# EAGLE design AS3364_DG412_bus_mixer_v1.4-4-layer (EAGLE 7.7.0)
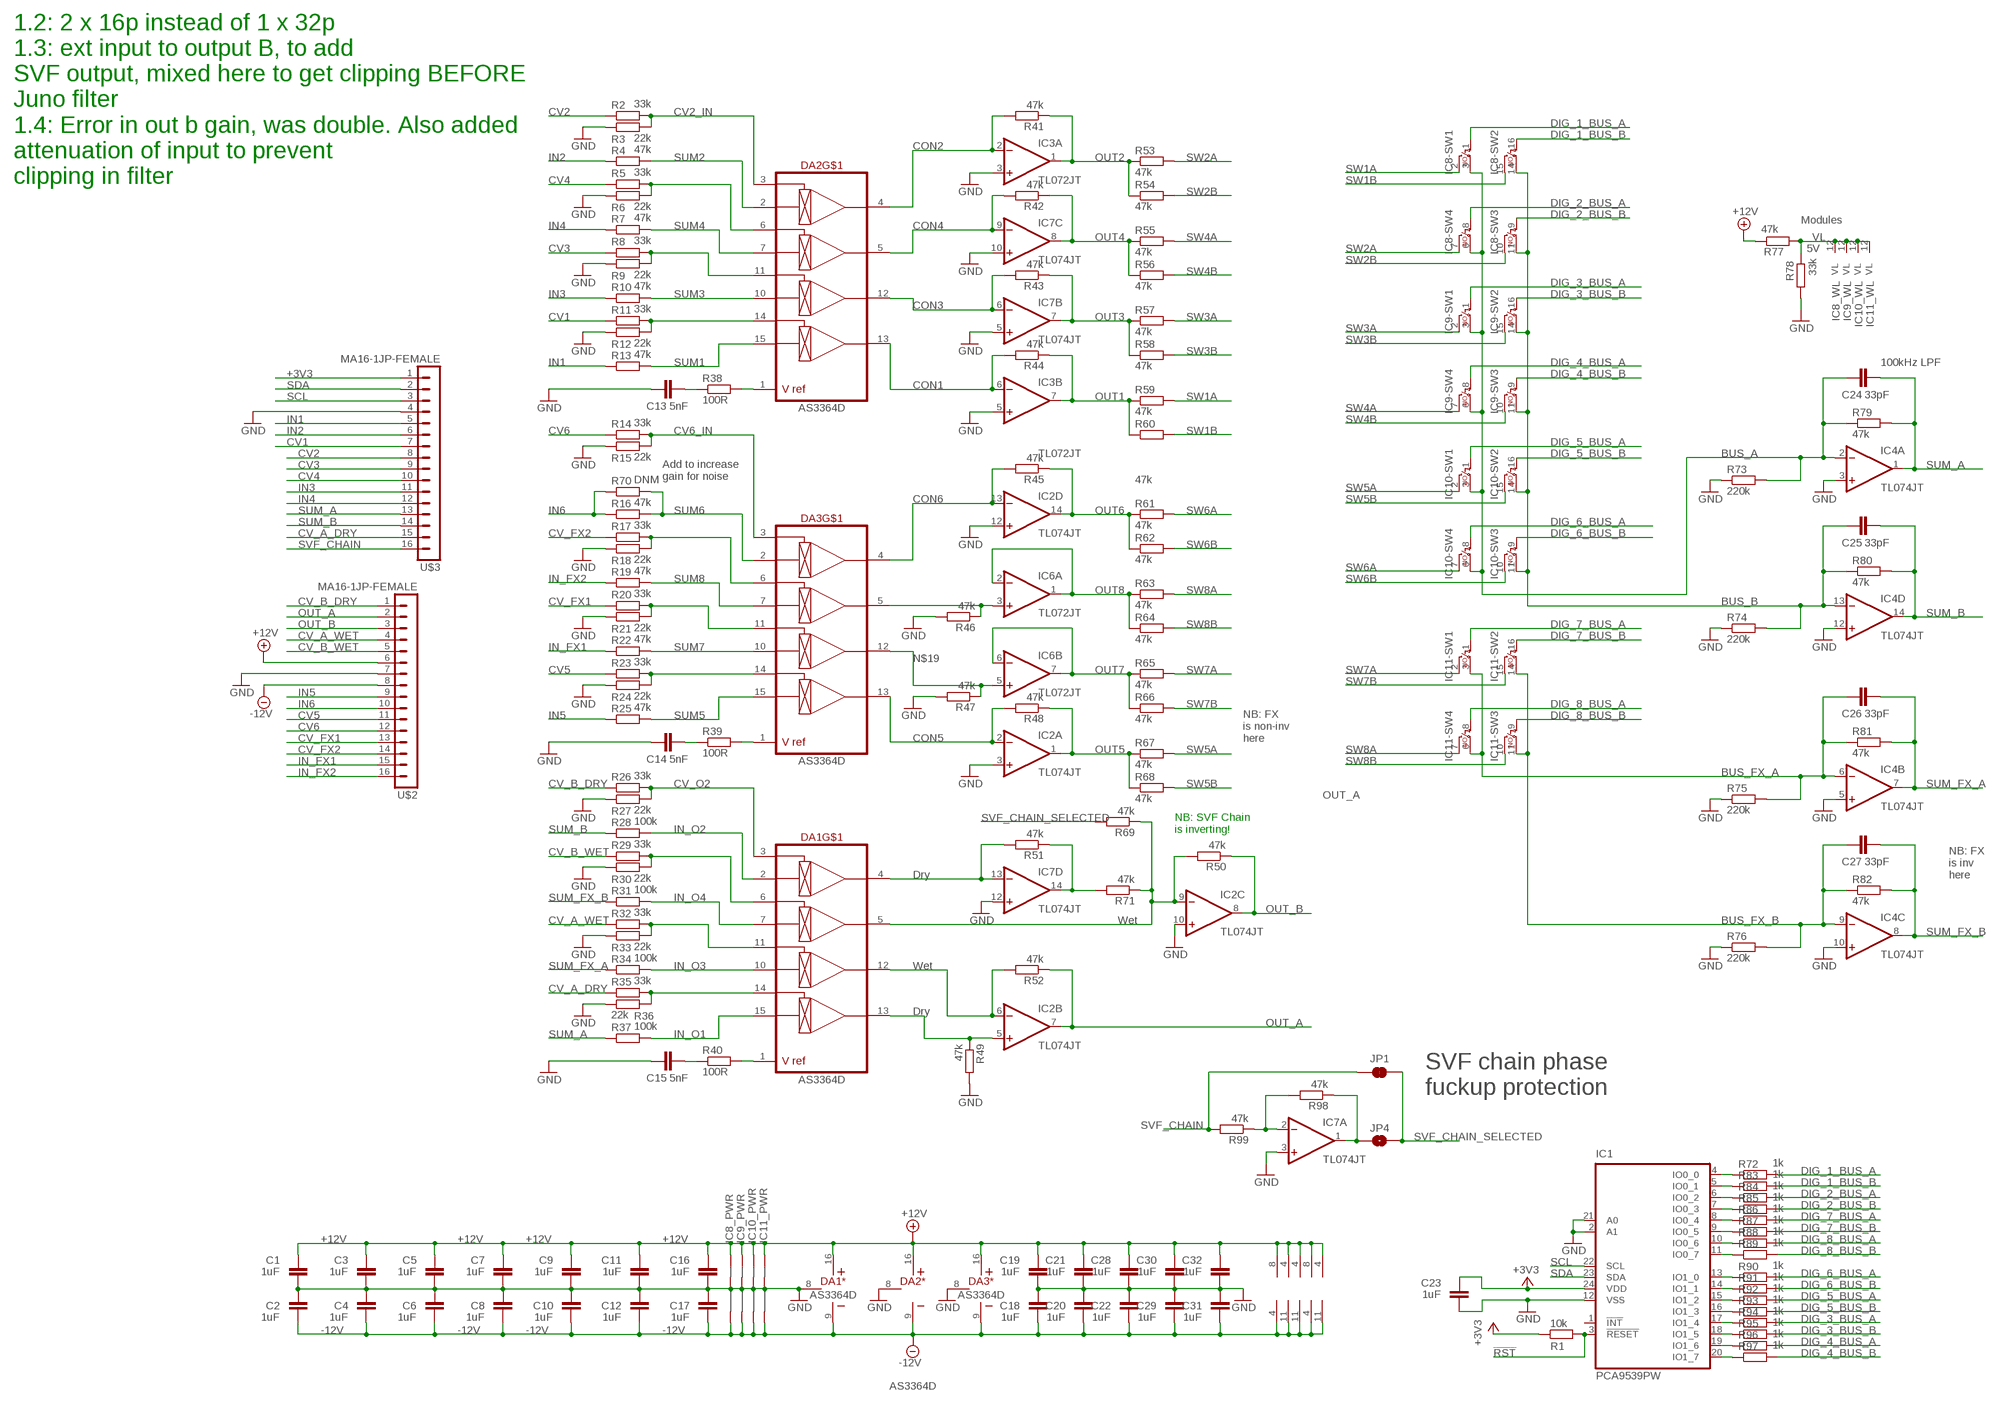
[diagram p0: schematic, sheet 1]

## Parts
C1  1uF  C-EU-J0402  [C0402-J]
C2  1uF  C-EU-J0402  [C0402-J]
C3  1uF  C-EU-J0402  [C0402-J]
C4  1uF  C-EU-J0402  [C0402-J]
C5  1uF  C-EU-J0402  [C0402-J]
C6  1uF  C-EU-J0402  [C0402-J]
C7  1uF  C-EU-J0402  [C0402-J]
C8  1uF  C-EU-J0402  [C0402-J]
C9  1uF  C-EU-J0402  [C0402-J]
C10  1uF  C-EU-J0402  [C0402-J]
C11  1uF  C-EU-J0402  [C0402-J]
C12  1uF  C-EU-J0402  [C0402-J]
C13  5nF  C-EU-J0402  [C0402-J]
C14  5nF  C-EU-J0402  [C0402-J]
C15  5nF  C-EU-J0402  [C0402-J]
C16  1uF  C-EU-J0402  [C0402-J]
C17  1uF  C-EU-J0402  [C0402-J]
C18  1uF  C-EU-J0402  [C0402-J]
C19  1uF  C-EU-J0402  [C0402-J]
C20  1uF  C-EU-J0402  [C0402-J]
C21  1uF  C-EU-J0402  [C0402-J]
C22  1uF  C-EU-J0402  [C0402-J]
C23  1uF  C-EU-J0402  [C0402-J]
C24  33pF  C-EU-J0402  [C0402-J]
C25  33pF  C-EU-J0402  [C0402-J]
C26  33pF  C-EU-J0402  [C0402-J]
C27  33pF  C-EU-J0402  [C0402-J]
C28  1uF  C-EU-J0402  [C0402-J]
C29  1uF  C-EU-J0402  [C0402-J]
C30  1uF  C-EU-J0402  [C0402-J]
C31  1uF  C-EU-J0402  [C0402-J]
C32  1uF  C-EU-J0402  [C0402-J]
DA1  AS3364D  [DIL16J]
DA2  AS3364D  [DIL16J]
DA3  AS3364D  [DIL16J]
IC1  PCA9539PW  [TSSOP24J]
IC2  TL074JT  [TSSOP14J]
IC3  TL072JT  [TSSOP8J]
IC4  TL074JT  [TSSOP14J]
IC6  TL072JT  [TSSOP8J]
IC7  TL074JT  [TSSOP14J]
IC8  DG412-J  [DIL16J]
IC9  DG412-J  [DIL16J]
IC10  DG412-J  [DIL16J]
IC11  DG412-J  [DIL16J]
JP1  JUMPER-SMT_2_NC_TRACE_SILK-DNM  JUMPER-SMT_2_NC_TRACE_SILK  [SMT-JUMPER_2_NC_TRACE_SILK]
JP4  JUMPER-SMT_2_NO_SILK-DNM  JUMPER-SMT_2_NO_SILK  [SMT-JUMPER_2_NO_SILK]
R1  10k  R-EU_R0402  [R0402]
R2  33k  R-EU_R0402  [R0402]
R3  22k  R-EU_R0402  [R0402]
R4  47k  R-EU_R0402  [R0402]
R5  33k  R-EU_R0402  [R0402]
R6  22k  R-EU_R0402  [R0402]
R7  47k  R-EU_R0402  [R0402]
R8  33k  R-EU_R0402  [R0402]
R9  22k  R-EU_R0402  [R0402]
R10  47k  R-EU_R0402  [R0402]
R11  33k  R-EU_R0402  [R0402]
R12  22k  R-EU_R0402  [R0402]
R13  47k  R-EU_R0402  [R0402]
R14  33k  R-EU_R0402  [R0402]
R15  22k  R-EU_R0402  [R0402]
R16  47k  R-EU_R0402  [R0402]
R17  33k  R-EU_R0402  [R0402]
R18  22k  R-EU_R0402  [R0402]
R19  47k  R-EU_R0402  [R0402]
R20  33k  R-EU_R0402  [R0402]
R21  22k  R-EU_R0402  [R0402]
R22  47k  R-EU_R0402  [R0402]
R23  33k  R-EU_R0402  [R0402]
R24  22k  R-EU_R0402  [R0402]
R25  47k  R-EU_R0402  [R0402]
R26  33k  R-EU_R0402  [R0402]
R27  22k  R-EU_R0402  [R0402]
R28  100k  R-EU_R0402  [R0402]
R29  33k  R-EU_R0402  [R0402]
R30  22k  R-EU_R0402  [R0402]
R31  100k  R-EU_R0402  [R0402]
R32  33k  R-EU_R0402  [R0402]
R33  22k  R-EU_R0402  [R0402]
R34  100k  R-EU_R0402  [R0402]
R35  33k  R-EU_R0402  [R0402]
R36  22k  R-EU_R0402  [R0402]
R37  100k  R-EU_R0402  [R0402]
R38  100R  R-EU_R0402  [R0402]
R39  100R  R-EU_R0402  [R0402]
R40  100R  R-EU_R0402  [R0402]
R41  47k  R-EU_R0402  [R0402]
R42  47k  R-EU_R0402  [R0402]
R43  47k  R-EU_R0402  [R0402]
R44  47k  R-EU_R0402  [R0402]
R45  47k  R-EU_R0402  [R0402]
R46  47k  R-EU_R0402  [R0402]
R47  47k  R-EU_R0402  [R0402]
R48  47k  R-EU_R0402  [R0402]
R49  47k  R-EU_R0402  [R0402]
R50  47k  R-EU_R0402  [R0402]
R51  47k  R-EU_R0402  [R0402]
R52  47k  R-EU_R0402  [R0402]
R53  47k  R-EU_R0402  [R0402]
R54  47k  R-EU_R0402  [R0402]
R55  47k  R-EU_R0402  [R0402]
R56  47k  R-EU_R0402  [R0402]
R57  47k  R-EU_R0402  [R0402]
R58  47k  R-EU_R0402  [R0402]
R59  47k  R-EU_R0402  [R0402]
R60  47k  R-EU_R0402  [R0402]
R61  47k  R-EU_R0402  [R0402]
R62  47k  R-EU_R0402  [R0402]
R63  47k  R-EU_R0402  [R0402]
R64  47k  R-EU_R0402  [R0402]
R65  47k  R-EU_R0402  [R0402]
R66  47k  R-EU_R0402  [R0402]
R67  47k  R-EU_R0402  [R0402]
R68  47k  R-EU_R0402  [R0402]
R69  47k  R-EU_R0402  [R0402]
R70  DNM  R-EU_R0805  [R0805]
R71  47k  R-EU_R0402  [R0402]
R72  1k  R-EU_R0402  [R0402]
R73  220k  R-EU_R0603  [R0603]
R74  220k  R-EU_R0603  [R0603]
R75  220k  R-EU_R0603  [R0603]
R76  220k  R-EU_R0603  [R0603]
R77  47k  R-EU_R0402  [R0402]
R78  33k  R-EU_R0402  [R0402]
R79  47k  R-EU_R0402  [R0402]
R80  47k  R-EU_R0402  [R0402]
R81  47k  R-EU_R0402  [R0402]
R82  47k  R-EU_R0402  [R0402]
R83  1k  R-EU_R0402  [R0402]
R84  1k  R-EU_R0402  [R0402]
R85  1k  R-EU_R0402  [R0402]
R86  1k  R-EU_R0402  [R0402]
R87  1k  R-EU_R0402  [R0402]
R88  1k  R-EU_R0402  [R0402]
R89  1k  R-EU_R0402  [R0402]
R90  1k  R-EU_R0402  [R0402]
R91  1k  R-EU_R0402  [R0402]
R92  1k  R-EU_R0402  [R0402]
R93  1k  R-EU_R0402  [R0402]
R94  1k  R-EU_R0402  [R0402]
R95  1k  R-EU_R0402  [R0402]
R96  1k  R-EU_R0402  [R0402]
R97  1k  R-EU_R0402  [R0402]
R98  47k  R-EU_R0402  [R0402]
R99  47k  R-EU_R0402  [R0402]
U$2  MA16-1JP-FEMALE  MA16-1JP  [SIP-PIN16-1J]
U$3  MA16-1JP-FEMALE  MA16-1JP  [SIP-PIN16-1J]

## Nets
!RST: IC1.3(!RESET) R1.2
+3V3: C23.2 IC1.24(VDD) R1.1 U$3.1
+12V: C1.2 C3.2 C5.2 C7.2 C9.2 C11.2 C16.2 C19.2 C21.2 C28.2 C30.2 C32.2 DA1.16(*:V+) DA2.16(*:V+) DA3.16(*:V+) IC2.4(P:V+) IC3.8(P:V+) IC4.4(P:V+) IC6.8(P:V+) IC7.4(P:V+) IC8.13(_PWR:+15V) IC9.13(_PWR:+15V) IC10.13(_PWR:+15V) IC11.13(_PWR:+15V) R77.1 U$2.6
-12V: C2.1 C4.1 C6.1 C8.1 C10.1 C12.1 C17.1 C18.1 C20.1 C22.1 C29.1 C31.1 DA1.9(*:V-) DA2.9(*:V-) DA3.9(*:V-) IC2.11(P:V-) IC3.4(P:V-) IC4.11(P:V-) IC6.4(P:V-) IC7.11(P:V-) IC8.4(_PWR:-15V) IC9.4(_PWR:-15V) IC10.4(_PWR:-15V) IC11.4(_PWR:-15V) U$2.8
BUS_A: C24.1 IC4.2(A:-IN) IC8.3(-SW1:S) IC8.6(-SW4:S) IC9.3(-SW1:S) IC9.6(-SW4:S) IC10.3(-SW1:S) IC10.6(-SW4:S) R73.2 R79.1
BUS_B: C25.1 IC4.13(D:-IN) IC8.11(-SW3:S) IC8.14(-SW2:S) IC9.11(-SW3:S) IC9.14(-SW2:S) IC10.11(-SW3:S) IC10.14(-SW2:S) R74.2 R80.1
BUS_FX_A: C26.1 IC4.6(B:-IN) IC11.3(-SW1:S) IC11.6(-SW4:S) R75.2 R81.1
BUS_FX_B: C27.1 IC4.9(C:-IN) IC11.11(-SW3:S) IC11.14(-SW2:S) R76.2 R82.1
CON1: DA2.13(OUT4) IC3.6(B:-IN) R44.2
CON2: DA2.4(OUT1) IC3.2(A:-IN) R41.2
CON3: DA2.12(OUT3) IC7.6(B:-IN) R43.2
CON4: DA2.5(OUT2) IC7.9(C:-IN) R42.2
CON5: DA3.13(OUT4) IC2.2(A:-IN) R48.2
CON6: DA3.4(OUT1) IC2.13(D:-IN) R45.2
CON_O1: DA1.12(OUT3) IC2.6(B:-IN) R52.2
CV1: R11.1 U$3.7
CV2: R2.1 U$3.8
CV2_IN: DA2.3(CV1) R2.2 R3.2
CV3: R8.1 U$3.9
CV4: R5.1 U$3.10
CV5: R23.1 U$2.11
CV6: R14.1 U$2.12
CV6_IN: DA3.3(CV1) R14.2 R15.2
CV_A_DRY: R35.1 U$3.15
CV_A_WET: R32.1 U$2.4
CV_B_DRY: R26.1 U$2.1
CV_B_WET: R29.1 U$2.5
CV_FX1: R20.1 U$2.13
CV_FX2: R17.1 U$2.14
CV_O2: DA1.3(CV1) R26.2 R27.2
DIG_1_BUS_A: IC8.1(-SW1:C) R72.2
DIG_1_BUS_B: IC8.16(-SW2:C) R83.2
DIG_2_BUS_A: IC8.8(-SW4:C) R84.2
DIG_2_BUS_B: IC8.9(-SW3:C) R85.2
DIG_3_BUS_A: IC9.1(-SW1:C) R94.2
DIG_3_BUS_B: IC9.16(-SW2:C) R95.2
DIG_4_BUS_A: IC9.8(-SW4:C) R96.2
DIG_4_BUS_B: IC9.9(-SW3:C) R97.2
DIG_5_BUS_A: IC10.1(-SW1:C) R92.2
DIG_5_BUS_B: IC10.16(-SW2:C) R93.2
DIG_6_BUS_A: IC10.8(-SW4:C) R90.2
DIG_6_BUS_B: IC10.9(-SW3:C) R91.2
DIG_7_BUS_A: IC11.1(-SW1:C) R86.2
DIG_7_BUS_B: IC11.16(-SW2:C) R87.2
DIG_8_BUS_A: IC11.8(-SW4:C) R88.2
DIG_8_BUS_B: IC11.9(-SW3:C) R89.2
GND: C1.1 C2.2 C3.1 C4.2 C5.1 C6.2 C7.1 C8.2 C9.1 C10.2 C11.1 C12.2 C13.1 C14.1 C15.1 C16.1 C17.2 C18.2 C19.1 C20.2 C21.1 C22.2 C23.1 C28.1 C29.2 C30.1 C31.2 C32.1 DA1.8(*:GND) DA2.8(*:GND) DA3.8(*:GND) IC1.2(A1) IC1.12(VSS) IC1.21(A0) IC2.3(A:+IN) IC2.10(C:+IN) IC2.12(D:+IN) IC3.3(A:+IN) IC3.5(B:+IN) IC4.3(A:+IN) IC4.5(B:+IN) IC4.10(C:+IN) IC4.12(D:+IN) IC7.3(A:+IN) IC7.5(B:+IN) IC7.10(C:+IN) IC7.12(D:+IN) IC8.5(_PWR:AGND) IC9.5(_PWR:AGND) IC10.5(_PWR:AGND) IC11.5(_PWR:AGND) R3.1 R6.1 R9.1 R12.1 R15.1 R18.1 R21.1 R24.1 R27.1 R30.1 R33.1 R36.1 R46.2 R47.2 R49.2 R73.1 R74.1 R75.1 R76.1 R78.2 U$2.7 U$3.4
IN1: R13.1 U$3.5
IN2: R4.1 U$3.6
IN3: R10.1 U$3.11
IN4: R7.1 U$3.12
IN5: R25.1 U$2.9
IN6: R16.1 R70.1 U$2.10
IN_FX1: R22.1 U$2.15
IN_FX2: R19.1 U$2.16
IN_O1: DA1.15(IN4) R37.2
IN_O2: DA1.2(IN1) R28.2
IN_O3: DA1.10(IN3) R34.2
IN_O4: DA1.7(IN2) R31.2
N$1: DA3.1(VREF) R39.2
N$2: DA2.1(VREF) R38.2
N$3: DA3.6(CV2) R17.2 R18.2
N$4: DA3.5(OUT2) IC6.3(A:+IN) R46.1
N$5: DA3.11(CV3) R20.2 R21.2
N$6: DA1.5(OUT2) IC2.9(C:-IN) R50.2 R69.1 R71.1
N$7: DA3.14(CV4) R23.2 R24.2
N$8: C14.2 R39.1
N$9: DA1.1(VREF) R40.2
N$10: DA2.6(CV2) R5.2 R6.2
N$11: DA1.6(CV2) R29.2 R30.2
N$12: DA2.11(CV3) R8.2 R9.2
N$13: DA1.11(CV3) R32.2 R33.2
N$14: C13.2 R38.1
N$15: DA1.14(CV4) R35.2 R36.2
N$16: C15.2 R40.1
N$17: DA1.4(OUT1) IC7.13(D:-IN) R51.2
N$18: DA1.13(OUT4) IC2.5(B:+IN) R49.1
N$19: DA3.12(OUT3) IC6.5(B:+IN) R47.1
N$20: IC7.14(D:OUT) R51.1 R71.2
N$21: DA2.14(CV4) R11.2 R12.2
N$22: IC7.1(A:OUT) JP4.1 R98.1
N$23: IC1.4(IO0_0) R72.1
N$24: IC1.5(IO0_1) R83.1
N$25: IC1.6(IO0_2) R84.1
N$26: IC1.7(IO0_3) R85.1
N$27: IC1.8(IO0_4) R86.1
N$28: IC1.9(IO0_5) R87.1
N$29: IC1.10(IO0_6) R88.1
N$30: IC1.11(IO0_7) R89.1
N$31: IC1.13(IO1_0) R90.1
N$32: IC1.14(IO1_1) R91.1
N$33: IC1.15(IO1_2) R92.1
N$34: IC1.16(IO1_3) R93.1
N$35: IC1.17(IO1_4) R94.1
N$36: IC1.18(IO1_5) R95.1
N$37: IC1.19(IO1_6) R96.1
N$38: IC1.20(IO1_7) R97.1
N$44: IC7.2(A:-IN) R98.2 R99.1
OUT1: IC3.7(B:OUT) R44.1 R59.1 R60.1
OUT2: IC3.1(A:OUT) R41.1 R53.1 R54.1
OUT3: IC7.7(B:OUT) R43.1 R57.1 R58.1
OUT4: IC7.8(C:OUT) R42.1 R55.1 R56.1
OUT5: IC2.1(A:OUT) R48.1 R67.1 R68.1
OUT6: IC2.14(D:OUT) R45.1 R61.1 R62.1
OUT7: IC6.6(B:-IN) IC6.7(B:OUT) R65.1 R66.1
OUT8: IC6.1(A:OUT) IC6.2(A:-IN) R63.1 R64.1
OUT_A: IC2.7(B:OUT) R52.1 U$2.2
OUT_B: IC2.8(C:OUT) R50.1 U$2.3
SCL: IC1.22(SCL) U$3.3
SDA: IC1.23(SDA) U$3.2
SUM1: DA2.15(IN4) R13.2
SUM2: DA2.2(IN1) R4.2
SUM3: DA2.10(IN3) R10.2
SUM4: DA2.7(IN2) R7.2
SUM5: DA3.15(IN4) R25.2
SUM6: DA3.2(IN1) R16.2 R70.2
SUM7: DA3.10(IN3) R22.2
SUM8: DA3.7(IN2) R19.2
SUM_A: C24.2 IC4.1(A:OUT) R37.1 R79.2 U$3.13
SUM_B: C25.2 IC4.14(D:OUT) R28.1 R80.2 U$3.14
SUM_FX_A: C26.2 IC4.7(B:OUT) R34.1 R81.2
SUM_FX_B: C27.2 IC4.8(C:OUT) R31.1 R82.2
SVF_CHAIN: JP1.1 R99.2 U$3.16
SVF_CHAIN_SELECTED: JP1.2 JP4.2 R69.2
SW1A: IC8.2(-SW1:D) R59.2
SW1B: IC8.15(-SW2:D) R60.2
SW2A: IC8.7(-SW4:D) R53.2
SW2B: IC8.10(-SW3:D) R54.2
SW3A: IC9.2(-SW1:D) R57.2
SW3B: IC9.15(-SW2:D) R58.2
SW4A: IC9.7(-SW4:D) R55.2
SW4B: IC9.10(-SW3:D) R56.2
SW5A: IC10.2(-SW1:D) R67.2
SW5B: IC10.15(-SW2:D) R68.2
SW6A: IC10.7(-SW4:D) R61.2
SW6B: IC10.10(-SW3:D) R62.2
SW7A: IC11.2(-SW1:D) R65.2
SW7B: IC11.15(-SW2:D) R66.2
SW8A: IC11.7(-SW4:D) R63.2
SW8B: IC11.10(-SW3:D) R64.2
VL: IC8.12(_WL:VL) IC9.12(_WL:VL) IC10.12(_WL:VL) IC11.12(_WL:VL) R77.2 R78.1
Unconnected: IC1.1(!INT)

## Notes on the sheet
- 1.2: 2 x 16p instead of 1 x 32p
  1.3: ext input to output B, to add
  SVF output, mixed here to get clipping BEFORE
  Juno filter
  1.4: Error in out b gain, was double. Also added 
  attenuation of input to prevent 
  clipping in filter
- Modules
- 5V
- 100kHz LPF
- Add to increase
  gain for noise
- NB: FX
  is non-inv
  here
- NB: SVF Chain
  is inverting!
- Dry
- NB: FX
  is inv
  here
- Wet
- Wet
- Dry
- SVF chain phase
  fuckup protection

## Library data of the parts
C1-C32 = joakim:C-EU-J: CAPACITOR, European symbol
DA1-DA3 = joakim:AS3364: AS3364 quad linear VCA, CEM3360 style. CV is 0 to 2V Vcc-Vee = 26V max, so +/-12V or +15V/-9V
IC1 = joakim:PCA9539: 16ch i/o expander. RPW version resets only internal statemachine to get out of stuck i2c-bus, other versions also reset outputs. Interrupt output requires external pull-up resistor for all variants. https://www.nxp.com/docs/en/data-sheet/PCA9539_PCA9539R.pdf
IC2 IC4 IC7 = joakim:TL074J: OP AMP
IC3 IC6 = joakim:TL072J: OP AMP
IC8-IC11 = joakim:DG412-J: Quad switch, normally open
JP1 = SparkFun-Jumpers:JUMPER-SMT_2_NC_TRACE: Normally closed trace jumper This jumper has a trace between two pads so it's normally closed (NC). Use a razor knife to open the connection. For best results follow the IPC guidelines for cutting traces: Cutout at least 0.063 mm (0.005 in). Remove all loose material to clean up the cut area. Seal the cut with an approved epoxy. Reapply solder to reclose the connection.
JP4 = SparkFun-Jumpers:JUMPER-SMT_2_NO: Normally open jumper This jumper has two pads in close proximity to each other. Apply solder to close the connection. Round pads are easier to solder for beginners, but are a lot larger. SparkFun Product that uses the round pads: SparkFun EL Sequencer <https://www.sparkfun.com/products/12781>
R1-R99 = rcl:R-EU_: RESISTOR, European symbol; SPICEPREFIX: R
U$2 U$3 = joakim:MA16-1J

## Board
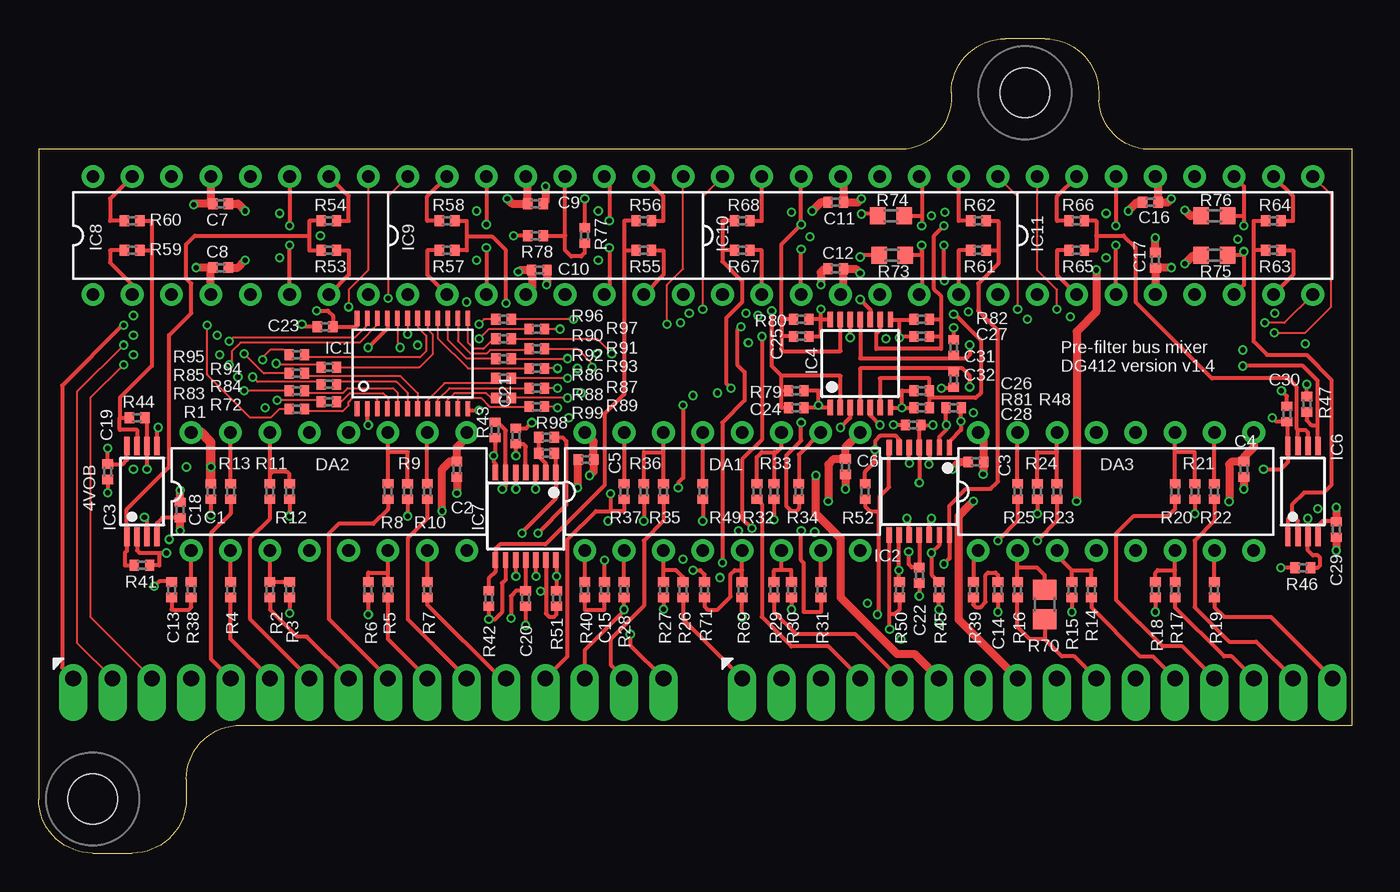
[diagram p1: board, top side]
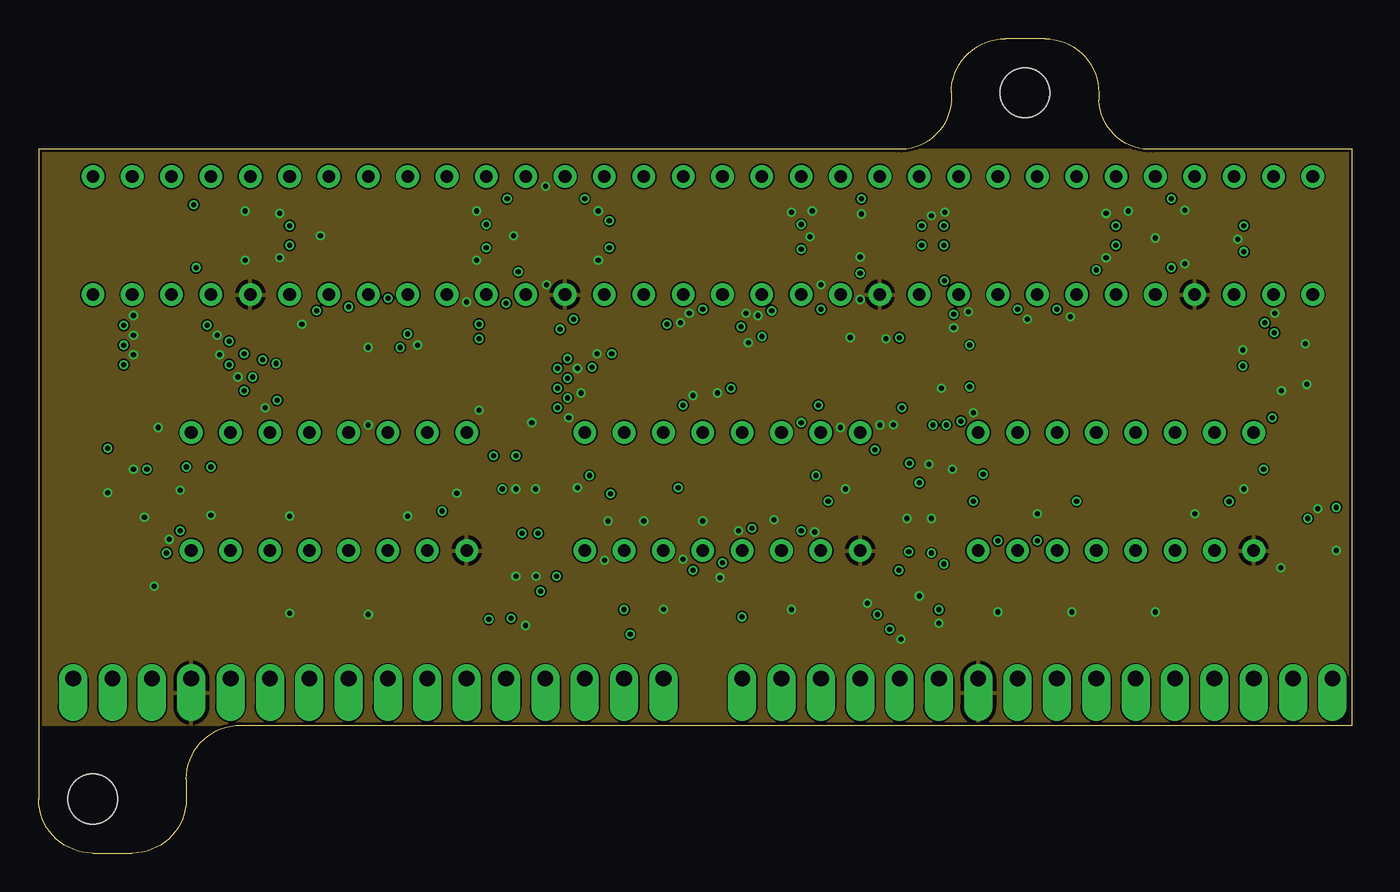
[diagram p2: board, inner layer Route2]
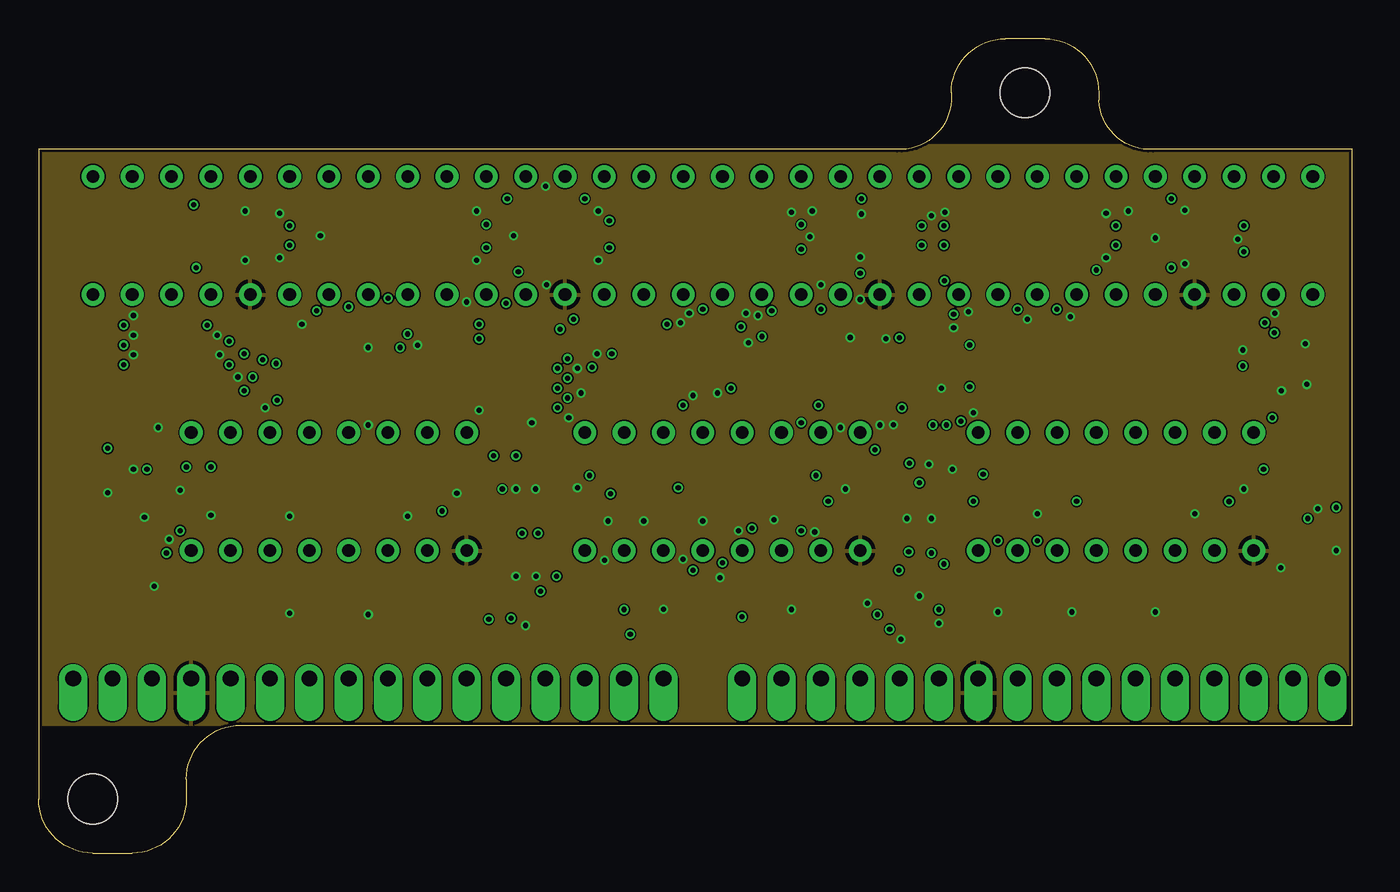
[diagram p3: board, inner layer Route15]
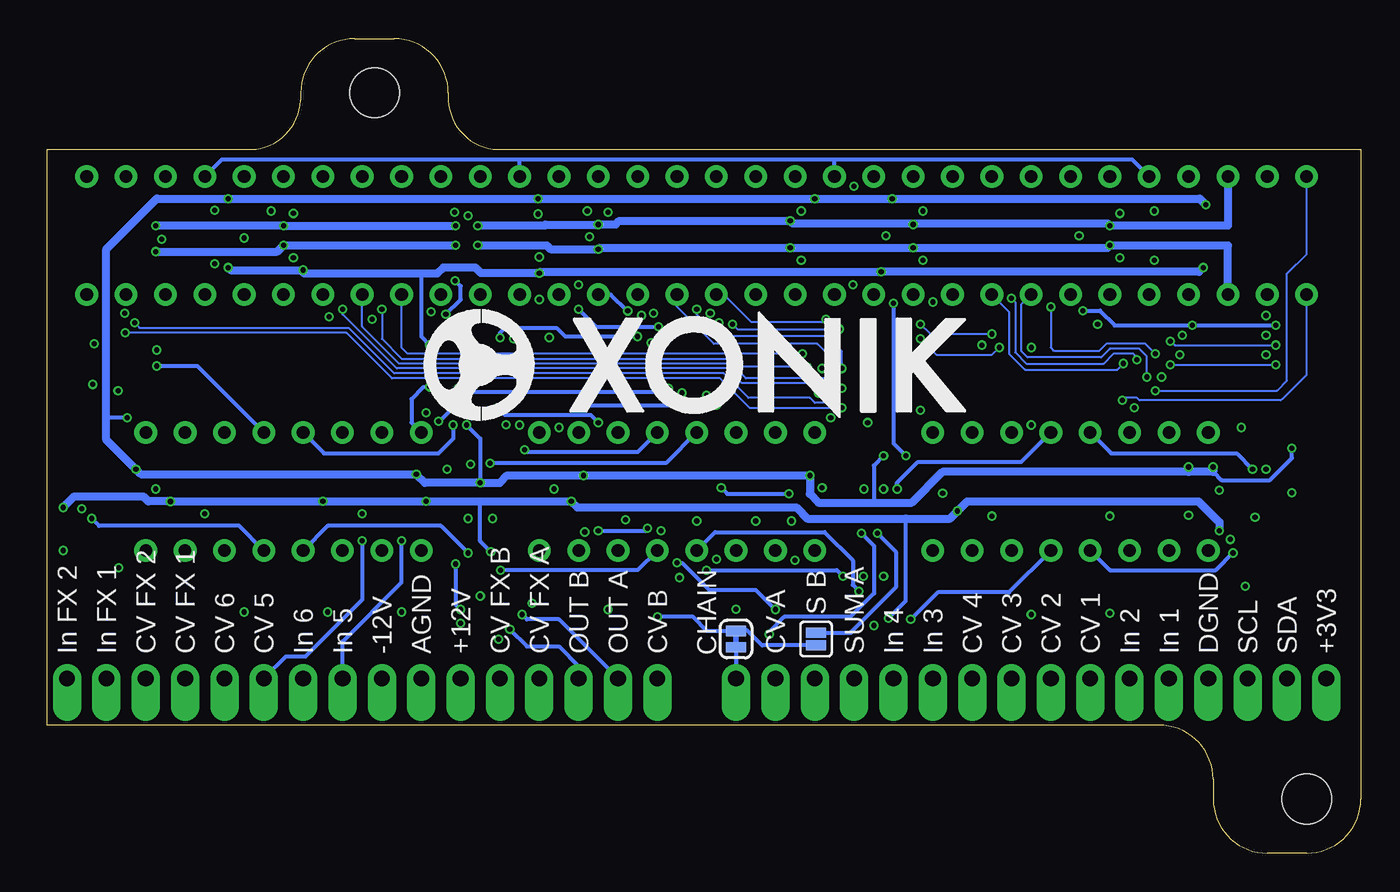
[diagram p4: board, bottom side, seen from below]

Size 84.77 x 52.55 mm. Coordinates in mm from the lower left corner, seen from the top.
Outline: 3.49,0 6.03,0 arc90 9.52,3.49 9.52,4.76 arc-90 13.02,8.26 84.77,8.26 84.77,45.4 71.91,45.4 arc-90 68.42,48.58 68.42,49.05 arc90 64.93,52.55 62.39,52.55 arc90 58.9,49.05 58.9,48.58 arc-90 55.4,45.4 0,45.4 0,3.49 arc90 3.49,0
Copper layers (1+2*15+16): Top 0.035mm / dielectric 0.2mm / Route2 0.0175mm / dielectric 1.065mm / Route15 0.0175mm / dielectric 0.2mm / Bottom 0.035mm
Design rules "jlcpcb-4layers": minimum track width 3.5mil, minimum drill 0.2mm, track to track 3.5mil, track to pad 5mil, pad to pad 5mil, via to via 5mil, smd to smd 5mil, copper to edge 0.2mm, drill to drill 6mil, minimum pad ring 10mil, minimum via ring 0.13mm, stop-mask expansion 0.05mm, vias tented up to drill 16mil, thermal gap 10mil
Holes 3.2 mm at 63.66,49.05 3.49,3.49

### Footprints (pad centres in the part's own frame; a part is rotated, then mirrored left to right if it is on the bottom)
C0402-J = smd 0.6 x 0.7: 1 -0.5,0; 2 0.5,0
DIL16J = drill 0.813: 1 -8.89,-3.81; 2 -6.35,-3.81; 3 -3.81,-3.81; 4 -1.27,-3.81; 5 1.27,-3.81; 6 3.81,-3.81; 7 6.35,-3.81; 8 8.89,-3.81; 9 8.89,3.81; 10 6.35,3.81; 11 3.81,3.81; 12 1.27,3.81; 13 -1.27,3.81; 14 -3.81,3.81; 15 -6.35,3.81; 16 -8.89,3.81
TSSOP24J = smd 0.305 x 0.991: 1 -3.575,-2.918; 2 -2.925,-2.918; 3 -2.275,-2.918; 4 -1.625,-2.918; 5 -0.975,-2.918; 6 -0.325,-2.918; 7 0.325,-2.918; 8 0.975,-2.918; 9 1.625,-2.918; 10 2.275,-2.918; 11 2.925,-2.918; 12 3.575,-2.918; 13 3.575,2.918; 14 2.925,2.918; 15 2.275,2.918; 16 1.625,2.918; 17 0.975,2.918; 18 0.325,2.918; 19 -0.325,2.918; 20 -0.975,2.918; 21 -1.625,2.918; 22 -2.275,2.918; 23 -2.925,2.918; 24 -3.575,2.918
TSSOP14J = smd 0.35 x 1: 1 -1.95,-2.825; 2 -1.3,-2.825; 3 -0.65,-2.825; 4 0,-2.825; 5 0.65,-2.825; 6 1.3,-2.825; 7 1.95,-2.825; 8 1.95,2.825; 9 1.3,2.825; 10 0.65,2.825; 11 0,2.825; 12 -0.65,2.825; 13 -1.3,2.825; 14 -1.95,2.825
TSSOP8J = smd 1.2 x 0.35: 1 -2.925,0.975; 2 -2.925,0.325; 3 -2.925,-0.325; 4 -2.925,-0.975; 5 2.925,-0.975; 6 2.925,-0.325; 7 2.925,0.325; 8 2.925,0.975
SMT-JUMPER_2_NC_TRACE_SILK = smd 0.66 x 1.27: 1 -0.521,0; 2 0.521,0
SMT-JUMPER_2_NO_SILK = smd 0.635 x 1.27: 1 -0.406,0; 2 0.406,0
R0402 = smd 0.6 x 0.7: 1 -0.5,0; 2 0.5,0
R0805 = smd 1.3 x 1.5: 1 -0.95,0; 2 0.95,0
R0603 = smd 1 x 1.1: 1 -0.85,0; 2 0.85,0
SIP-PIN16-1J = drill 1.016 offset: 1 -19.05,0; 2 -16.51,0; 3 -13.97,0; 4 -11.43,0; 5 -8.89,0; 6 -6.35,0; 7 -3.81,0; 8 -1.27,0; 9 1.27,0; 10 3.81,0; 11 6.35,0; 12 8.89,0; 13 11.43,0; 14 13.97,0; 15 16.51,0; 16 19.05,0

### Placement (x,y rotation side)
C1  11.11,23.34 90 top
C2  26.99,24.77 270 top
C3  60.48,25.24 0 top
C4  77.79,24.77 270 top
C5  35.32,25.4 0 top
C6  52.07,24.92 270 top
C7  11.75,41.91 180 top
C8  11.75,37.78 0 top
C9  32.07,41.91 180 top
C10  32.31,37.62 0 top
C11  51.44,41.99 0 top
C12  51.44,37.7 180 top
C13  8.57,16.99 270 top
C14  61.91,16.99 90 top
C15  36.51,16.99 270 top
C16  71.75,41.99 0 top
C17  72.07,38.26 90 top
C18  9.13,22.15 90 top
C19  4.45,24.61 90 top
C20  31.43,16.43 270 top
C21  30.8,26.91 270 top
C22  56.83,17.94 270 top
C23  18.49,33.97 0 top
C24  48.9,29.84 0 top
C25  49.21,33.34 0 top
C26  56.99,29.84 180 top
C27  56.99,33.34 180 top
C28  56.44,27.62 0 top
C29  83.74,20.88 270 top
C30  80.57,28.34 270 top
C31  59.05,32.62 90 top
C32  59.05,30.56 90 top
DA1  44.13,23.34 0 top
DA2  18.73,23.34 0 top
DA3  69.53,23.34 0 top
IC1  24.13,31.59 0 top
IC2  56.83,23.34 180 top
IC3  6.67,23.34 90 top
IC4  53.02,31.59 0 top
IC6  81.6,23.34 90 top
IC7  31.43,21.75 180 top
IC8  12.38,39.85 0 top
IC9  32.7,39.85 0 top
IC10  53.02,39.85 0 top
IC11  73.34,39.85 0 top
JP1  40.32,13.81 90 bottom
JP4  35.16,13.81 270 bottom
R1  16.67,28.65 0 top
R2  14.92,16.99 90 top
R3  16.19,16.99 90 top
R4  12.38,16.99 90 top
R5  22.54,16.99 90 top
R6  21.27,16.99 90 top
R7  25.08,16.99 90 top
R8  22.54,23.34 90 top
R9  23.81,23.34 90 top
R10  25.08,23.34 90 top
R11  14.92,23.34 90 top
R12  16.19,23.34 90 top
R13  12.38,23.34 90 top
R14  67.95,16.99 90 top
R15  66.67,16.99 90 top
R16  63.18,16.99 90 top
R17  73.34,16.99 90 top
R18  72.07,16.99 90 top
R19  75.88,16.99 90 top
R20  73.34,23.34 90 top
R21  74.61,23.34 90 top
R22  75.88,23.34 90 top
R23  65.72,23.34 90 top
R24  64.45,23.34 90 top
R25  63.18,23.34 90 top
R26  41.59,16.99 90 top
R27  40.32,16.99 90 top
R28  37.78,16.99 90 top
R29  47.47,16.99 90 top
R30  48.58,16.99 90 top
R31  50.48,16.99 90 top
R32  46.36,23.34 90 top
R33  47.47,23.34 90 top
R34  49.05,23.34 90 top
R35  40.32,23.34 90 top
R36  39.05,23.34 90 top
R37  37.78,23.34 90 top
R38  9.84,16.99 90 top
R39  60.33,16.99 90 top
R40  35.24,16.99 90 top
R41  6.67,18.57 0 top
R42  29.05,16.43 270 top
R43  29.45,27.3 90 top
R44  6.35,28.1 0 top
R45  58.1,16.99 90 top
R46  81.6,18.41 180 top
R47  81.84,28.97 90 top
R48  59.05,28.73 180 top
R49  42.86,23.34 270 top
R50  55.56,16.99 90 top
R51  33.42,16.43 270 top
R52  53.34,23.34 90 top
R53  18.73,38.89 0 top
R54  18.73,40.8 0 top
R55  39.05,38.89 0 top
R56  39.05,40.8 0 top
R57  26.35,38.89 180 top
R58  26.35,40.8 180 top
R59  6.03,38.89 180 top
R60  6.03,40.8 180 top
R61  60.64,38.89 180 top
R62  60.64,40.8 180 top
R63  79.69,38.89 0 top
R64  79.69,40.8 0 top
R65  66.99,38.89 180 top
R66  66.99,40.8 180 top
R67  45.4,38.89 0 top
R68  45.4,40.8 0 top
R69  45.4,16.99 270 top
R70  64.93,16.03 90 top
R71  42.98,16.99 90 top
R72  18.73,29.13 180 top
R73  55.09,38.58 0 top
R74  55.01,41.12 0 top
R75  75.88,38.58 0 top
R76  75.88,41.12 0 top
R77  35.24,39.85 270 top
R78  32.07,39.85 180 top
R79  48.9,28.73 0 top
R80  49.21,34.45 0 top
R81  56.99,28.73 180 top
R82  56.99,34.45 180 top
R83  16.67,29.84 180 top
R84  18.73,30.24 180 top
R85  16.67,30.96 180 top
R86  30,30.64 0 top
R87  32.15,30 0 top
R88  30,29.37 0 top
R89  32.15,28.81 0 top
R90  30,33.18 0 top
R91  32.15,32.54 0 top
R92  30,31.91 0 top
R93  32.15,31.27 0 top
R94  18.73,31.35 180 top
R95  16.67,32.15 180 top
R96  30,34.45 0 top
R97  32.15,33.81 0 top
R98  32.78,25.8 180 top
R99  32.78,26.83 0 top
U$1  [XONIK_LOGO_35]  60.48,27.94 0 bottom
U$2  64.45,11.27 0 top
U$3  21.27,11.27 0 top

### Tracks (layer width: path | path; a pad name or v marks a point on that pad's centre or on a via)
!RST
  Top 0.127: IC1.3 21.85,29.26 21.75,29.37 20.24,29.37 20,29.13 20,28.89 19.61,28.5 17.33,28.5 R1.2
+3V3  (via drill 0.33)
  Top 0.127: R1.1 15.53,28.65 14.98,28.1 13.65,28.1 10.87,30.88 v10.87,34.05
  Top 0.254: U$3.1 1.51,11.99 1.51,30.16 5.4,34.05 v5.48,34.05 | IC1.24 20.55,34.05 20.48,33.97 C23.2 18.99,34.66 18.65,35 v17.94,35
  Bottom 0.254: v17.94,35 16.83,35 15.88,34.05 v10.87,34.05 v5.48,34.05
+12V  (via drill 0.33, 0.35)
  Top 0.254: v35.24,42.23 R77.1 | IC4.4 53.02,31.27 59.04,31.27 | v79.06,24.77 80.17,24.77 80.64,25.24 80.64,26.24 IC6.8 80.62,27.78 C30.2 79.87,27.84 v79.61,28.1 | v56.83,23.89 IC2.4 56.83,27.52 C28.2 v57.71,27.62 | v4.45,26.11 C19.2 5.42,25.11 5.69,25.38 IC3.8 | C32.2 59.04,31.07 59.04,31.27 | v60.09,30.08 60.09,30.8 59.61,31.27 59.04,31.27 | IC7.4 31.43,26.24 31.26,26.41 C21.2 v30.8,25.64
  Top 0.508: C7.2 11.11,41.91 | 11.11,41.91 10.01,41.91 v10,41.83 | U$2.6 56.51,12.86 55.4,12.86 51.75,16.51 51.75,20.32 50.16,21.91 v50.16,24.37 | IC8.13 11.11,41.91 | v30.24,42.23 30.56,41.91 C9.2 31.57,43.52 IC9.13 | IC10.13 51.94,43.47 C11.2 52.86,41.99 v53.1,42.23 | v73.1,42.23 72.87,41.99 C16.2 72.25,43.47 IC11.13 | DA3.16 60.98,26.8 C3.2 60.98,24.47 v60.96,24.45 | DA1.16 35.82,26.57 C5.2 35.82,24.63 v35.56,24.37
  Top 0.61: C1.2 v11.11,24.92 11.11,26.51 10.48,27.15 DA2.16
  Bottom 0.254: 9.53,24.61 8.99,24.06 5.86,24.06 4.45,25.48 v4.45,26.11 | v79.61,28.1 80.96,28.1 | v60.09,30.08 60.48,30.08 61.28,29.29 61.28,27.78 DA3.16 | v57.71,27.62 56.83,26.75 v56.83,23.89 | v30.8,25.64 31.43,25 31.43,22.62
  Bottom 0.508: v9.52,24.92 9.52,24.61 9.53,24.61 11.11,24.61 | v10,41.83 10.4,42.23 v30.24,42.23 v35.24,42.23 v53.1,42.23 v73.1,42.23 77.71,42.23 80.96,38.97 80.96,28.1 80.96,26.67 v79.06,24.77 78.74,24.45 v60.96,24.45 60.4,23.89 v56.83,23.89 55.56,23.89 55.09,24.37 v50.16,24.37 v35.56,24.37 35.56,23.18 35,22.62 31.43,22.62 28.97,22.62 26.99,24.61 11.11,24.61 | v11.11,24.92 11.11,24.61
-12V  (via drill 0.33, 0.35)
  Top 0.254: IC4.11 53.02,31.91 59.05,31.91 | C18.1 7.99,21.65 7.64,21.3 IC3.4 | IC7.11 C20.1 30.82,16.93 30.48,16.59 v30.48,15.16 | IC2.11 C22.1 56.36,18.44 56.15,18.64 v56.15,19.45 | IC6.4 82.57,21.14 82.87,21.43 83.69,21.43 C29.1 | C31.1 59.05,31.91 | v60.09,32.79 60.09,32.15 59.85,31.91 59.05,31.91
  Top 0.508: DA2.9 27.62,26.83 26.99,26.19 C2.1 26.53,25.27 26.03,24.77 v26.03,22.07 | v68.26,37.62 68.26,34.93 66.99,33.66 v66.99,22.7 | U$2.8 59.37,15.08 59.37,21.75 v60.33,22.7 | C8.1 11.11,37.78 | 11.11,37.78 v10.16,37.78 | IC8.4 11.11,37.78 | IC9.4 31.83,36.43 31.83,37.6 C10.1 31.08,37.62 v30.96,37.51 | v73.1,37.78 73.08,37.76 C17.1 IC11.4 | v76.83,22.7 76.83,25.08 76.99,25.24 77.76,25.24 C4.1 77.79,25.56 78.42,26.19 DA3.9 | DA1.9 52.07,26.19 C6.1 52.05,25.4 51.28,25.4 50.96,25.08 v50.96,22.7 | v53.02,37.43 52.74,37.7 C12.1 51.94,36.22 IC10.4 | v9.13,20.8 C18.1 | v83.74,22.3 C29.1
  Bottom 0.254: v68.26,37.62 68.34,37.54 | v30.48,15.16 29.37,16.27 29.37,21.59 | v56.15,19.45 56.83,20.12 56.83,22.7 | v60.09,32.79 60.64,33.34 60.64,37.39
  Bottom 0.508: v10.16,37.78 10.44,37.51 v30.96,37.51 52.94,37.51 v53.02,37.43 56.79,37.43 57.15,37.78 59.21,37.78 59.61,37.39 60.64,37.39 68.18,37.39 68.34,37.54 | v73.1,37.78 72.95,37.62 v68.26,37.62 | v9.13,20.8 9.13,21.35 10.48,22.7 25.4,22.7 v26.03,22.07 26.51,21.59 29.37,21.59 35.72,21.59 36.43,22.3 50.56,22.3 v50.96,22.7 56.83,22.7 v60.33,22.7 v66.99,22.7 v76.83,22.7 78.26,22.7 78.58,23.02 83.03,23.02 v83.74,22.3
BUS_A  (via drill 0.33)
  Top 0.254: v28.89,39.05 IC9.3 | v36.83,39.05 36.83,36.35 IC9.6 | IC8.6 v16.19,39.21 | IC10.3 v49.21,38.97 | IC10.6 56.99,36.2 v56.99,39.21 56.99,38.58 R73.2 | IC4.2 51.75,28.8 51.75,30.8 47.94,30.8 | v47.31,34.98 47.31,31.43 47.94,30.8 | R79.1 47.94,28.73 47.94,29.84 | 47.94,29.84 47.94,30.8 | C24.1 47.94,29.84
  Bottom 0.254: IC10.3 48.42,36.04 47.37,34.98 v47.31,34.98
  Bottom 0.508: IC8.3 8.57,39.21 v16.19,39.21 16.35,39.05 v28.89,39.05 v36.83,39.05 49.13,39.05 v49.21,38.97 52.31,38.97 52.55,39.21 v56.99,39.21
BUS_B  (via drill 0.33)
  Top 0.254: IC8.11 v16.19,40.48 | IC9.14 v28.89,40.56 | IC9.11 36.83,43.34 v36.83,40.8 | IC10.14 v49.21,40.56 47.94,39.29 47.94,34.45 | 56.99,41.12 v56.99,40.48 | R74.2 56.99,41.12 | 47.94,34.45 47.94,33.34 | 47.94,33.34 47.94,32.38 51.75,32.38 51.75,34.39 IC4.13 | R80.1 47.94,34.45 | IC10.11 56.99,43.5 56.99,41.12 | C25.1 47.94,33.34
  Bottom 0.508: IC8.14 8.57,40.48 v16.19,40.48 16.35,40.64 28.81,40.64 v28.89,40.56 28.97,40.64 36.67,40.64 v36.83,40.8 47.86,40.8 48.1,40.56 v49.21,40.56 52.63,40.56 52.7,40.48 v56.99,40.48
BUS_FX_A  (via drill 0.33)
  Top 0.254: IC11.3 v69.53,39.21 | IC11.6 77.79,36.67 v77.79,38.81 77.79,38.58 R75.2 | IC4.6 54.29,28.8 54.29,30.64 57.47,30.64 57.47,29.87 C26.1 57.47,29.82 57.47,29.37 | v58.45,36.94 58.42,36.98 v58.42,39.21 | R81.1 57.47,28.76 57.47,29.37 | v59.05,34.77 59.13,34.77 60.8,33.1 60.8,29.69 60.48,29.37 57.47,29.37
  Bottom 0.254: v58.45,36.94 58.1,36.59 58.1,35.72 v59.05,34.77
  Bottom 0.508: v77.79,38.81 69.93,38.81 v69.53,39.21 v58.42,39.21
BUS_FX_B  (via drill 0.33)
  Top 0.254: IC11.14 v69.53,40.48 | 77.79,41.12 77.79,43.02 IC11.11 | 77.79,41.12 v77.79,40.48 | R76.2 77.79,41.12 | R82.1 58.26,34.45 | 58.26,33.34 58.26,32.54 54.05,32.54 54.05,33.51 54.32,33.78 IC4.9 | 58.26,33.34 58.26,34.45 | 58.26,34.45 58.26,35.92 57.79,36.39 57.79,39.85 v58.42,40.48 | C27.1 58.26,33.34
  Bottom 0.508: v77.79,40.48 v69.53,40.48 v58.42,40.48
CON1  (via drill 0.33)
  Top 0.254: IC3.6 | R44.2 6.98,28.1 IC3.6 | v6.98,24.77 IC3.6
  Bottom 0.254: DA2.13 16.11,25.8 8.02,25.8 v6.98,24.77
CON2  (via drill 0.35)
  Top 0.254: IC3.2 6.34,19.53 6.51,19.37 v8.26,19.37 7.78,19.37 7.78,18.57 R41.2
  Bottom 0.254: v8.26,19.37 9.37,18.26 16.19,18.26 DA2.4
CON3  (via drill 0.33)
  Top 0.254: R43.2 29.61,27.8 30.13,27.28 IC7.6 30.13,23.7 v29.92,23.5
  Bottom 0.254: DA2.12 21.91,25.24 28.57,25.24 29.92,23.89 v29.92,23.5
CON4  (via drill 0.33)
  Top 0.254: IC7.9 30.13,17.65 29.89,17.42 29.89,15.53 29.45,15.08 v29.05,15.08 R42.2
  Bottom 0.254: DA2.5 22.7,16.83 27.3,16.83 v29.05,15.08
CON5  (via drill 0.33)
  Top 0.254: IC2.2 58.13,26.86 58.58,27.3 v58.58,27.62 58.55,27.65 R48.2
  Bottom 0.254: DA3.13 66.91,25.8 59.53,25.8 58.58,26.75 v58.58,27.62
CON6  (via drill 0.33)
  Top 0.254: R45.2 57.63,17.96 v57.63,19.37 58.13,19.87 IC2.13
  Bottom 0.254: DA3.4 66.67,21.11 59.37,21.11 v57.63,19.37
CON_O1  (via drill 0.33)
  Top 0.254: R52.2 53.34,24.61 53.98,25.24 v53.98,26.04 53.98,26.59 54.3,26.91 55.32,26.91 55.53,26.7 IC2.6
  Bottom 0.254: DA1.12 46.67,25.88 53.82,25.88 v53.98,26.04
CV1
  Top 0.254: R11.1 14.92,21.59 13.65,20.32 13.65,15.08 U$3.7
CV2
  Top 0.254: R2.1 14.92,15.72 16.67,13.97 17.3,13.97 U$3.8
CV2_IN
  Top 0.254: DA2.3 R2.2 R3.2
CV3
  Top 0.254: R8.1 22.54,22.2 21.59,21.25 19.34,21.25 18.73,20.64 18.73,15.1 U$3.9
CV4
  Top 0.254: U$3.10 22.54,13.81 R5.1
CV5  (via drill 0.33)
  Top 0.254: R23.1 65.72,21.43 v64.45,20.16
  Bottom 0.254: U$2.11 69.37,12.7 68.1,12.7 64.45,16.35 v64.45,20.16
CV6
  Top 0.254: R14.1 67.95,15.85 71.12,12.68 71.94,12.68 U$2.12
CV6_IN
  Top 0.254: R14.2 67.95,18.26 66.67,18.26 | 66.67,18.26 65.72,19.21 DA3.3 | R15.2 66.67,18.26
CV_A_DRY
  Top 0.254: R35.1 40.32,21.43 39.05,20.16 39.05,15.95 36.91,13.81 36.91,12.14 U$3.15
CV_A_WET
  Top 0.254: U$2.4 50.96,13.34 48.58,13.34 46.67,15.24 46.67,22.52 R32.1
CV_B_DRY
  Top 0.254: R26.1 41.59,15.08 U$2.1
CV_B_WET
  Top 0.254: R29.1 47.47,15.56 48.9,14.13 52.7,14.13 U$2.5
CV_FX1
  Top 0.254: U$2.13 73.82,13.34 72.55,13.34 69.53,16.35 69.53,20.61 70.64,21.73 72.87,21.73 73.34,22.2 R20.1
CV_FX2
  Top 0.254: R17.1 73.34,15.88 76.52,12.7 76.99,12.7 U$2.14
CV_O2
  Top 0.254: R27.2 40.32,18.28 | 40.32,18.28 DA1.3 | R26.2 41.59,17.8 41.12,18.28 40.32,18.28
DIG_1_BUS_A  (via drill 0.33)
  Top 0.127: R72.2 18.15,29.21 v15.4,29.21
  Bottom 0.127: v15.4,29.21 15.24,29.37 14.45,29.37 14.29,29.21 5.16,29.21 5.08,29.29 3.49,30.88 IC8.1
DIG_1_BUS_B  (via drill 0.33)
  Top 0.127: R83.2 v13.26,29.84
  Bottom 0.127: v13.26,29.84 5.4,29.84 4.76,30.48 4.76,37.39 3.49,38.66 IC8.16
DIG_2_BUS_A  (via drill 0.33)
  Top 0.127: R84.2 18.07,30.4 14.13,30.4 v13.81,30.72
  Bottom 0.127: IC8.8 21.91,35.4 21.91,32.38 21.51,31.99 16.75,31.99 16.19,32.54 14.29,32.54 13.81,32.07 v13.81,30.72
DIG_2_BUS_B  (via drill 0.33)
  Top 0.127: v20,35.24 20,36.35 21.27,37.62 IC8.9 | v13.26,32.23 14.53,30.96 R85.2
  Bottom 0.127: v20,35.24 20,32.63 19.76,32.38 16.91,32.38 16.43,32.86 13.89,32.86 v13.26,32.23
DIG_3_BUS_A  (via drill 0.33)
  Top 0.127: R94.2 18.07,31.51 15.4,31.51 v15.32,31.59
  Bottom 0.127: v15.32,31.59 15.72,31.19 21.67,31.19 22.7,32.23 22.7,34.93 IC9.1
DIG_3_BUS_B  (via drill 0.33)
  Top 0.127: R95.2 15.85,32.46 14.92,32.46 14.45,31.99 v14.45,31.83 | IC9.16 22.54,42.39 v22.54,35.8
  Bottom 0.127: v22.54,35.8 22.3,35.56 22.3,32.31 21.59,31.59 16.59,31.59 15.95,32.23 14.68,32.23 14.45,31.99 v14.45,31.83
DIG_4_BUS_A  (via drill 0.33)
  Top 0.127: v34.53,34.45 R96.2
  Bottom 0.127: IC9.8 41.12,36.04 39.37,34.29 34.69,34.29 v34.53,34.45
DIG_4_BUS_B  (via drill 0.33)
  Top 0.127: v33.66,33.81 R97.2 | v40.56,34.13 40.56,36.67 41.59,37.7 IC9.9
  Bottom 0.127: v33.66,33.81 40.24,33.81 v40.56,34.13
DIG_5_BUS_A  (via drill 0.33)
  Top 0.127: v34.13,31.91 R92.2
  Bottom 0.127: v34.13,31.91 35.08,32.86 41.75,32.86 44.13,35.24 IC10.1
DIG_5_BUS_B  (via drill 0.33)
  Top 0.127: v33.5,31.27 R93.2 | v42.86,35.08 42.86,42.39 IC10.16
  Bottom 0.127: v33.5,31.27 33.5,32.38 34.45,33.34 41.43,33.34 42.86,34.77 v42.86,35.08
DIG_6_BUS_A  (via drill 0.33)
  Top 0.127: R90.2 36.04,33.18 v36.99,32.23
  Bottom 0.127: v36.99,32.23 61.52,32.23 61.91,32.62 IC10.8
DIG_6_BUS_B  (via drill 0.33)
  Top 0.127: R91.2 34.76,32.54 35.72,31.59 v35.72,31.35 | IC10.9 63.18,42.39 v63.18,35.08
  Bottom 0.127: v35.72,31.35 35.8,31.43 39.93,31.43 40.4,31.91 61.91,31.91 63.18,33.18 v63.18,35.08
DIG_7_BUS_A  (via drill 0.33)
  Top 0.127: v34.13,30.64 R86.2
  Bottom 0.127: v34.13,30.64 39.69,30.64 40.64,31.59 62.07,31.59 64.45,33.97 IC11.1
DIG_7_BUS_B  (via drill 0.33)
  Top 0.127: v33.5,30 R87.2 | v65.72,35.08 65.72,36.35 64.45,37.62 IC11.16
  Bottom 0.127: v33.5,30 34.37,30 34.69,30.32 39.93,30.32 40.88,31.27 62.23,31.27 65.72,34.77 v65.72,35.08
DIG_8_BUS_A  (via drill 0.33)
  Top 0.127: v34.13,29.37 R88.2 | IC11.8 80.41,34.21 v79.14,34.21
  Bottom 0.127: v34.13,29.37 34.45,29.05 35.24,29.05 35.56,29.37 39.53,29.37 41.12,30.96 62.39,30.96 65.33,33.89 78.82,33.89 v79.14,34.21
DIG_8_BUS_B  (via drill 0.33)
  Top 0.127: v33.5,28.73 33.42,28.81 R89.2 | v79.76,33.58 81.74,33.58 83.42,35.26 83.42,42.47 IC11.9
  Bottom 0.127: v33.5,28.73 39.45,28.73 41.35,30.64 62.53,30.64 65.47,33.58 v79.76,33.58
GND  (via drill 0.33)
  Top 0.254: R6.1 v21.27,15.4 | R30.1 v48.58,15.72 | IC4.10 53.67,35.07 v53.02,35.72 | IC4.3 52.37,28.08 v51.75,27.46 | IC4.5 53.67,28.24 v54.29,27.62 | R36.1 v39.05,21.43 | R78.2 v30.64,39.85 | R74.1 54.03,41.24 v53.1,41.24 | R73.1 53.14,38.58 v53.02,38.46 | IC3.5 7.64,27.41 v7.7,27.46 | IC3.3 6.99,21.5 v6.83,21.67 | C13.1 8.52,17.54 7.78,17.54 v7.46,17.22 | R3.1 v16.19,15.48 | R9.1 v23.81,21.75 | IC7.3 32.08,23.51 v32.07,23.5 | IC7.5 30.78,23.51 v30.8,23.5 | v30.8,17.87 30.78,17.89 IC7.10 | IC7.12 32.08,17.89 v32.11,17.86 | R33.1 v47.47,21.51 | R49.2 v42.86,21.43 | R27.1 v40.32,15.73 | C15.1 v36.51,18.89 | C14.1 v61.91,15.56 | R15.1 v66.67,15.56 | R18.1 v72.07,15.56 | R46.2 v80.17,18.41 | IC2.10 56.18,21.45 v56.04,21.59 | IC2.12 57.48,21.45 v57.63,21.59 | IC2.3 57.48,25.1 v57.47,25.08 | R24.1 v64.45,21.91 | R21.1 v74.61,21.91 | R12.1 v16.19,21.75 | C1.1 v11.11,21.79 | C23.1 17.15,33.97 v16.99,34.13 | IC1.2 21.21,27.69 v21.27,27.62 | IC1.12 27.8,28.58 v28.42,28.58 | IC1.21 22.5,33.86 v21.27,32.62 | C19.1 v4.45,23.26 | C20.2 v31.43,14.68 | C22.2 v56.83,16.59 | R47.2 v81.84,30.24 | C30.1 80.57,29.49 v80.21,29.84 | C32.1 59,30 v58.26,30 | C31.2 v59.05,33.89 | C28.1 55.18,27.62 v55.17,27.63 | C21.1 31.46,27.41 v31.83,27.78 | IC4.12 v52.37,33.27
  Top 0.508: 77.77,24.1 C4.2 v77.79,23.5 | C7.1 12.86,41.91 v13.34,41.43 | C8.2 12.86,37.78 v13.34,38.26 | v32.7,43.02 32.73,43 32.73,42.07 C9.1 | C10.2 32.81,36.7 v32.78,36.67 | C11.1 50.48,41.99 v49.93,41.43 | C12.2 50.72,37.7 50.48,37.47 v50.48,36.67 | R75.1 74.53,38.58 v73.98,38.02 | R76.1 74.34,41.12 v73.98,41.48 | v70.33,41.43 70.88,41.99 C16.1 | C17.2 v72.07,39.69 | C2.2 v26.99,23.22 | C6.2 v52.07,23.5 | C18.2 v9.13,23.42 | C29.2 v83.74,19.53 | v58.98,24.78 59.44,25.24 C3.1 | C5.1 34.82,25.32 34.77,25.27 v34.77,23.57
  other vias: 6.11,34.69 6.11,32.15 6.11,33.42 11.51,33.42 11.67,32.15 12.86,30.72 14.61,28.73 27.62,35.56 41.43,34.21 41.99,34.85 43.81,29.69 45.64,34.85 36.04,32.23 34.77,31.27 35,29.69 34.21,28.1 42.23,29.53 36.75,21.43 45.16,20.8 50.09,20.72 41.59,18.97 8.41,20.24 6.11,24.77 43.97,17.78 53.5,16.11 55.64,13.81 58.1,14.84 82.55,22.23 79.77,34.85 81.76,32.86 77.71,32.46 63.82,34.45 66.6,34.61 60.01,34.93 54.69,33.18 45.8,32.94 46.43,34.69 60.33,28.42 24.45,32.78 15.56,41.28 18.18,39.85 15.56,38.42 48.58,41.35 57.63,41.12 58.5,41.35 68.9,41.28 77.39,39.61 36.12,41.43 49.77,39.77 28.26,41.43 28.26,38.26 36.12,38.26 68.9,38.42
  pour Route2: -0.32,45.4 85.09,45.4 85.09,8.26 -0.08,8.26 -0.32,8.49
  pour Route15: -1.27,45.72 85.88,45.72 85.88,8.26 -0.63,8.26 -0.63,45.09
IN1
  Top 0.254: U$3.5 11.11,12.54 11.11,20.64 12.38,21.91 R13.1
IN2
  Top 0.254: R4.1 12.38,13.81 U$3.6
IN3
  Top 0.254: U$3.11 23.81,15.08 23.81,20.32 25.08,21.59 R10.1
IN4
  Top 0.254: R7.1 25.08,16.03 29.84,11.27 U$3.12
IN5  (via drill 0.33)
  Top 0.254: R25.1 63.18,21.43 v61.91,20.16
  Bottom 0.254: v61.91,20.16 61.91,17.46 65.72,13.65 U$2.9
IN6
  Top 0.254: U$2.10 66.83,12.7 66.04,12.7 64.93,13.81 | R70.1 64.93,13.81 | 64.93,13.81 63.98,13.81 63.18,14.61 R16.1
IN_FX1
  Top 0.254: R22.1 75.88,21.43 74.61,20.16 74.61,15.88 76.83,13.65 78.58,13.65 U$2.15
IN_FX2
  Top 0.254: R19.1 75.88,15.88 76.52,15.24 79.53,15.24 U$2.16
IN_O1
  Top 0.254: DA1.15 R37.2
IN_O2
  Top 0.254: R28.2 DA1.2
IN_O3
  Top 0.254: R34.2 49.05,25.72 DA1.10
IN_O4
  Top 0.254: R31.2 DA1.7
N$1
  Top 0.254: R39.2 60.33,19.21 DA3.1
N$2
  Top 0.254: R38.2 DA2.1
N$3
  Top 0.254: R17.2 73.34,18.26 | 73.34,18.26 DA3.6 | R18.2 72.07,18.1 72.23,18.26 73.34,18.26
N$4  (via drill 0.33)
  Top 0.254: v81.92,21.59 IC6.3 81.92,19.53 82.25,19.21 82.55,19.21 82.71,19.05 82.71,18.57 82.55,18.41 R46.1
  Bottom 0.254: DA3.5 72.39,21.11 81.44,21.11 v81.92,21.59
N$5
  Top 0.254: R20.2 73.34,25.88 | 73.34,25.88 DA3.11 | R21.2 74.61,25.88 73.34,25.88
N$6  (via drill 0.33)
  Top 0.254: R50.2 55.53,17.52 v55.53,18.26 IC2.9 | R69.1 45.4,18.26 | 45.4,18.26 DA1.5 | R71.1 42.98,15.92 43.18,15.72 43.81,15.72 44.65,16.55 44.65,17.98 44.93,18.26 45.4,18.26
  Bottom 0.254: DA1.5 46.67,18.26 v55.53,18.26
N$7
  Top 0.254: R23.2 65.72,25.88 | 65.72,25.88 DA3.14 | R24.2 64.45,25.88 65.72,25.88
N$8
  Top 0.254: R39.1 60.33,16.03 60.48,15.88 60.8,15.88 61.12,16.19 61.12,17.94 61.28,18.1 61.75,18.1 61.91,17.94 C14.2
N$9
  Top 0.254: DA1.1 R40.2
N$10
  Top 0.254: R5.2 22.54,18.1 | 22.54,18.1 DA2.6 | R6.2 21.27,18.1 22.54,18.1
N$11
  Top 0.254: R29.2 47.47,18.26 47.94,18.26 | 47.94,18.26 DA1.6 | R30.2 48.58,18.26 47.94,18.26
N$12
  Top 0.254: R8.2 22.54,25.88 | 22.54,25.88 DA2.11 | R9.2 23.81,25.88 22.54,25.88
N$13
  Top 0.254: R32.2 46.36,25.56 46.67,25.88 47.47,25.88 | DA1.11 47.94,26.19 47.62,25.88 47.47,25.88 | 47.47,25.88 R33.2
N$14
  Top 0.254: C13.2 8.57,15.72 9.68,15.72 9.84,15.88 R38.1
N$15
  Top 0.254: R35.2 40.32,25.88 | 40.32,25.88 DA1.14 | R36.2 39.05,25.88 40.32,25.88
N$16
  Top 0.254: R40.1 35.24,15.72 36.51,15.72 C15.2
N$17  (via drill 0.33)
  Top 0.254: v32.39,16.91 32.73,16.91 IC7.13 32.73,15.45 32.94,15.24 33.26,15.24 33.42,15.4 R51.2
  Bottom 0.254: v32.39,16.91 32.78,17.3 32.78,18.89 34.61,20.72 41.67,20.72 DA1.4
N$18  (via drill 0.33)
  Top 0.254: v56.2,25.16 56.18,25.18 IC2.5 | R49.1 DA1.13
  Bottom 0.254: DA1.13 44.85,25.16 v56.2,25.16
N$19  (via drill 0.33)
  Top 0.254: IC6.5 82.55,26.28 82.55,27.62 | v77.71,31.43 81.6,31.43 82.55,30.48 82.55,27.62 | R47.1 81.84,27.94 82.15,27.62 82.55,27.62
  Bottom 0.254: DA3.12 75.09,31.43 v77.71,31.43
N$20  (via drill 0.33)
  Top 0.254: R71.2 42.98,17.96 42.69,18.26 v42.23,18.26 | IC7.14 33.42,18.89 v33.42,17.86 R51.1
  Bottom 0.254: v33.42,17.86 33.81,18.26 v42.23,18.26
N$21
  Top 0.254: R11.2 14.92,24.45 | 14.92,24.45 DA2.14 | R12.2 16.19,24.45 16.03,24.61 15.08,24.61 14.92,24.45
N$22  (via drill 0.33)
  Top 0.254: R98.1 33.38,25.65 IC7.1 33.38,22.91 31.19,20.72 v31.19,20.64
  Bottom 0.254: v31.19,20.64 30,19.45 30,17.15 32.93,14.22 JP4.1
N$23
  Top 0.127: R72.1 19.53,29.13 20.08,29.69 22.23,29.69 22.54,29.37 22.54,28.71
  Top 0.254: 22.54,28.71 IC1.4
N$24
  Top 0.127: IC1.5 23.16,29.71 22.86,30 19.92,30 19.61,29.69 17.33,29.69 R83.1
N$25
  Top 0.127: R84.1 19.39,30.4 23.1,30.4 23.8,29.69 IC1.6
N$26
  Top 0.127: IC1.7 24.46,29.68 23.34,30.8 17.33,30.8 R85.1
N$27
  Top 0.127: IC1.8 25.1,29.23 26.19,30.32 29.19,30.32 R86.1
N$28
  Top 0.127: IC1.9 25.75,29.25 26.51,30 R87.1
N$29
  Top 0.127: IC1.10 26.41,29.26 26.83,29.69 28.87,29.69 29.19,29.37 R88.1
N$30
  Top 0.127: IC1.11 27.05,29.28 27.15,29.37 28.55,29.37 29.11,28.81 R89.1
N$31
  Top 0.127: R90.1 29.34,33.18 28.71,32.54 28.1,32.54 27.7,32.94 IC1.13
N$32
  Top 0.127: IC1.14 27.05,33.03 27.86,32.23 28.9,32.23 29.12,32.45 31.55,32.45 R91.1
N$33
  Top 0.127: R92.1 27.62,31.91 26.41,33.13 IC1.15
N$34
  Top 0.127: IC1.16 25.75,33.22 27.7,31.27 R93.1
N$35
  Top 0.127: R94.1 24.58,31.35 25.42,32.2 25.42,33.48 25.1,33.8 IC1.17
N$36
  Top 0.127: IC1.18 24.46,33.95 25.01,33.4 25.01,32.39 24.61,31.99 17.33,31.99 R95.1
N$37  (via drill 0.33)
  Top 0.127: IC1.19 v23.8,33.5 v23.81,33.5 | v28.42,34.13 28.73,34.45 R96.1
  Bottom 0.127: v28.42,34.13 27.78,33.5 v23.81,33.5
N$38  (via drill 0.33)
  Top 0.127: R97.1 29.05,33.81 v28.42,33.18 | IC1.20 23.16,32.8 v23.34,32.62
  Bottom 0.127: v28.42,33.18 27.38,32.15 23.81,32.15 v23.34,32.62
N$44
  Top 0.254: IC7.2 32.73,25.13 32.28,25.58 R98.2 R99.1
OUT1
  Top 0.254: R59.1 7.3,38.89 | R60.1 7.3,40.8 7.3,38.89 | IC3.7 6.35,27.3 5.24,27.3 5.24,28.1 | 5.24,28.1 R44.1 | 5.24,28.1 5.24,29.37 7.3,31.43 7.3,38.89
OUT2
  Top 0.254: R54.1 17.46,40.8 17.46,39.85 | 17.46,39.85 17.46,38.89 R53.1 | R41.1 5.56,18.57 5.56,19.37 5.69,19.5 IC3.1 5.69,22.2 8.41,24.92 8.41,33.42 9.84,34.85 9.84,36.75 9.52,37.07 9.52,39.29 10.08,39.85 17.46,39.85
OUT3  (via drill 0.33)
  Top 0.254: R58.1 27.62,40.8 27.62,39.77 | 27.62,39.77 27.62,38.89 R57.1 | v30.16,35.48 30.16,38.89 29.29,39.77 27.62,39.77 | R43.1 29.45,25.72 v29.37,25.64 29.37,25.24 29.48,25.13 IC7.7
  Bottom 0.254: v29.37,25.64 30.16,26.43 v30.16,35.48
OUT4
  Top 0.254: 37.78,38.89 R55.1 | R56.1 37.78,40.8 37.78,38.89 | 37.78,38.89 37.78,29.61 36.51,28.34 36.51,23.73 32.7,19.92 29.77,19.92 29.48,19.64 IC7.8 29.48,18.16 29.05,17.72 R42.1
OUT5  (via drill 0.33)
  Top 0.254: R68.1 44.13,40.8 44.13,38.89 | R67.1 44.13,38.89 | IC2.1 58.78,26.56 59.53,27.3 v59.53,27.86 59.53,28.71 R48.1 | 44.13,38.89 44.13,38.18 45.4,36.91 45.4,35.56 44.37,34.53 44.37,30.32 v44.69,30
  Bottom 0.254: v44.69,30 44.93,29.77 57.55,29.77 59.45,27.86 v59.53,27.86
OUT6  (via drill 0.33)
  Top 0.254: R61.1 61.94,38.89 | R62.1 61.91,40.8 61.94,40.78 61.94,38.89 | 61.94,38.89 61.94,38.04 60.64,36.75 60.64,35 61.91,33.73 61.91,23.97 61.44,23.5 59.85,23.5 58.78,22.43 IC2.14 58.78,19.02 v58.42,18.65 | v58.1,15.72 R45.1
  Bottom 0.254: v58.42,18.65 58.42,16.03 v58.1,15.72
OUT7
  Top 0.254: R65.1 68.26,38.89 68.26,39.85 | 68.26,39.85 68.26,40.8 R66.1 | 68.26,39.85 70.01,39.85 70.8,39.05 70.8,35.56 75.72,30.64 80.64,30.64 81.2,30.08 81.2,27.38 81.28,27.3 | 81.28,27.3 81.76,27.3 81.92,27.14 IC6.6 | 81.28,27.3 IC6.7
OUT8
  Top 0.254: R63.1 78.42,38.89 | 78.42,38.89 78.42,40.8 R64.1 | 78.42,38.89 78.42,33.02 79.3,32.15 81.84,32.15 83.42,30.56 83.42,23.73 82.95,23.26 81.68,23.26 80.88,22.46 80.88,21.83 | IC6.1 80.62,21.57 80.88,21.83 | IC6.2 81.28,21.43 80.88,21.83
OUT_A  (via drill 0.33)
  Top 0.254: IC2.7 54.88,23.61 54.29,23.02 54.29,22.07 54.21,22.07 | v54.13,15.4 54.21,15.48 54.21,22.07 | R52.1 53.34,22.38 53.66,22.07 54.21,22.07
  Bottom 0.254: v54.13,15.4 53.82,15.08 51.75,15.08 U$2.2
OUT_B  (via drill 0.33)
  Top 0.254: IC2.8 54.88,15.4 | 54.88,15.4 54.88,14.49 v54.93,14.45 | R50.1 55.56,15.72 55.24,15.4 54.88,15.4
  Bottom 0.254: U$2.3 50.48,12.07 51.75,13.34 53.82,13.34 v54.93,14.45
SCL  (via drill 0.33)
  Top 0.127: v5.48,31.51 3.33,29.37 3.33,15.24 U$3.3 | IC1.22 21.85,34.08 20.72,32.94 13.02,32.94 12.46,32.38 12.46,31.67 v12.3,31.51
  Bottom 0.127: v12.3,31.51 v5.48,31.51
SDA  (via drill 0.33)
  Top 0.127: v5.48,32.78 2.46,29.77 2.46,13.57 U$3.2 | IC1.23 21.21,34.06 20.4,33.26 12.54,33.26 v12.3,33.02
  Bottom 0.127: v5.48,32.78 11.99,32.78 12.26,33.06 v12.3,33.02
SUM1
  Top 0.254: R13.2 DA2.15
SUM2
  Top 0.254: R4.2 DA2.2
SUM3
  Top 0.254: R10.2 DA2.10
SUM4
  Top 0.254: DA2.7 R7.2
SUM5
  Top 0.254: R25.2 DA3.15
SUM6
  Top 0.254: R16.2 63.18,18.41 | 63.18,18.41 DA3.2 | R70.2 64.93,17.94 64.45,18.41 63.18,18.41
SUM7
  Top 0.254: R22.2 DA3.10
SUM8
  Top 0.254: R19.2 DA3.7
SUM_A  (via drill 0.33)
  Top 0.254: 50.32,28.73 51.04,28.73 IC4.1 | 50.32,28.73 v50.32,28.89 50.32,29.84 C24.2 | 50.32,28.73 R79.2 | v36.91,23.18 36.91,22.07 | 36.91,22.07 37.78,22.07 R37.1 | v41.59,28.89 41.59,24.21 41.27,23.89 v41.27,23.57 | 36.91,22.07 35.96,22.07 34.13,20.24 34.13,12.7 U$3.13
  Bottom 0.254: v50.32,28.89 v41.59,28.89 | v41.27,23.57 40.88,23.18 v36.91,23.18
SUM_B  (via drill 0.33)
  Top 0.254: 50.48,34.45 R80.2 | 50.48,34.45 51.04,34.45 IC4.14 | 50.48,34.45 v50.48,35.08 | R28.1 v37.78,15.72 37.78,15.64 35.24,13.1 U$3.14 | v45.32,33.97 45.09,33.73 45.09,31.51 45.56,31.04 45.56,29.21 44.13,27.78 v44.13,18.73 | C25.2 50.48,33.34 50.48,34.45
  Bottom 0.254: v50.48,35.08 49.37,33.97 v45.32,33.97 | v44.13,18.73 43.81,18.73 42.07,16.99 39.05,16.99 v37.78,15.72
SUM_FX_A  (via drill 0.33)
  Top 0.254: IC4.7 55.01,28.73 v55.72,28.73 | v55.72,28.73 R81.2 | v49.21,27.78 49.21,26.62 48.26,25.67 48.26,22.38 48.58,22.07 48.9,22.07 49.05,22.23 R34.1 | v55.72,28.73 55.72,29.84 C26.2
  Bottom 0.254: v49.21,27.78 49.69,28.26 55.24,28.26 v55.72,28.73
SUM_FX_B  (via drill 0.33)
  Top 0.254: v46.04,20.95 45.4,21.59 45.4,25.4 46.67,26.67 v46.67,33.34 | R31.1 50.48,15.56 49.37,15.56 49.37,18.73 49.21,18.89 v49.21,20.8 | C27.2 55.56,33.34 v55.56,33.26 55.56,34.37 56.49,34.37 R82.2 56.41,34.37 55.02,34.37 IC4.8
  Bottom 0.254: v55.56,33.26 55.56,33.58 55.24,33.89 51.91,33.89 51.36,33.34 v46.67,33.34 | v49.21,20.8 46.2,20.8 v46.04,20.95
SVF_CHAIN  (via drill 0.33)
  Top 0.254: R99.2 33.81,26.83 34.05,26.59 34.05,22.46 v32.23,20.64 | v38.18,14.13 38.18,13.41 U$3.16
  Bottom 0.254: JP1.1 U$3.16 | v32.23,20.64 31.42,19.83 31.42,16.76 32.94,15.24 37.23,15.24 38.18,14.29 v38.18,14.13
SVF_CHAIN_SELECTED  (via drill 0.33)
  Top 0.254: v45.4,15.24 R69.2
  Bottom 0.254: v45.4,15.24 43.1,15.24 42.19,14.33 JP1.2 40.29,14.37 39.61,14.37 38.65,13.41 JP4.2
SW1A
  Top 0.254: R59.2 4.6,38.89 4.6,38.1 6.03,36.67 IC8.2
SW1B
  Top 0.254: IC8.15 4.6,42.23 4.6,40.8 R60.2
SW2A
  Top 0.254: R53.2 20,38.89 20,37.31 IC8.7
SW2B
  Top 0.254: R54.2 20,40.8 20,42.39 IC8.10
SW3A
  Top 0.254: R57.2 25.08,38.89 25.08,37.31 IC9.2
SW3B
  Top 0.254: R58.2 25.08,40.8 25.08,42.39 IC9.15
SW4A
  Top 0.254: R55.2 40.32,38.89 40.32,37.31 IC9.7
SW4B
  Top 0.254: R56.2 40.32,40.8 40.32,42.39 IC9.10
SW5A
  Top 0.254: R67.2 46.67,38.89 IC10.2
SW5B
  Top 0.254: R68.2 46.67,40.8 IC10.15
SW6A
  Top 0.254: IC10.7 59.37,38.89 R61.2
SW6B
  Top 0.254: R62.2 59.37,40.8 IC10.10
SW7A
  Top 0.254: R65.2 65.72,38.89 65.72,37.31 IC11.2
SW7B
  Top 0.254: R66.2 65.72,40.8 65.72,42.39 IC11.15
SW8A
  Top 0.254: R63.2 80.96,38.89 80.96,37.31 IC11.7
SW8B
  Top 0.254: R64.2 80.96,40.8 80.96,42.39 IC11.10
VL
  Top 0.254: R77.2 35.24,38.73 35,38.5 34.37,38.5 33.97,38.89 33.97,39.85 | 33.97,39.85 IC9.12 | R78.1 33.97,39.85
  Bottom 0.254: IC9.12 33.97,44.77 | 33.97,44.77 14.76,44.77 IC8.12 | IC10.12 54.29,44.77 | 54.29,44.77 33.97,44.77 | IC11.12 73.5,44.77 54.29,44.77

### Text on the board
tNames: Pre-filter bus mixer / DG412 version v1.4 | 4VOB
bNames: S B | +3V3 | SDA | SCL | DGND | In 1 | In 2 | CV 1 | CV 2 | CV 3 | CV 4 | In 3 | In 4 | SUM A | CV A | CHAIN | CV B | OUT A | OUT B | CV FX A | CV FX B | +12V | AGND | -12V | In 5 | In 6 | CV 5 | CV 6 | CV FX 1 | CV FX 2 | In FX 1 | In FX 2